# EAGLE design bird_beaks 3.0 (EAGLE 9.6.2)

## Sheet 1 of 2
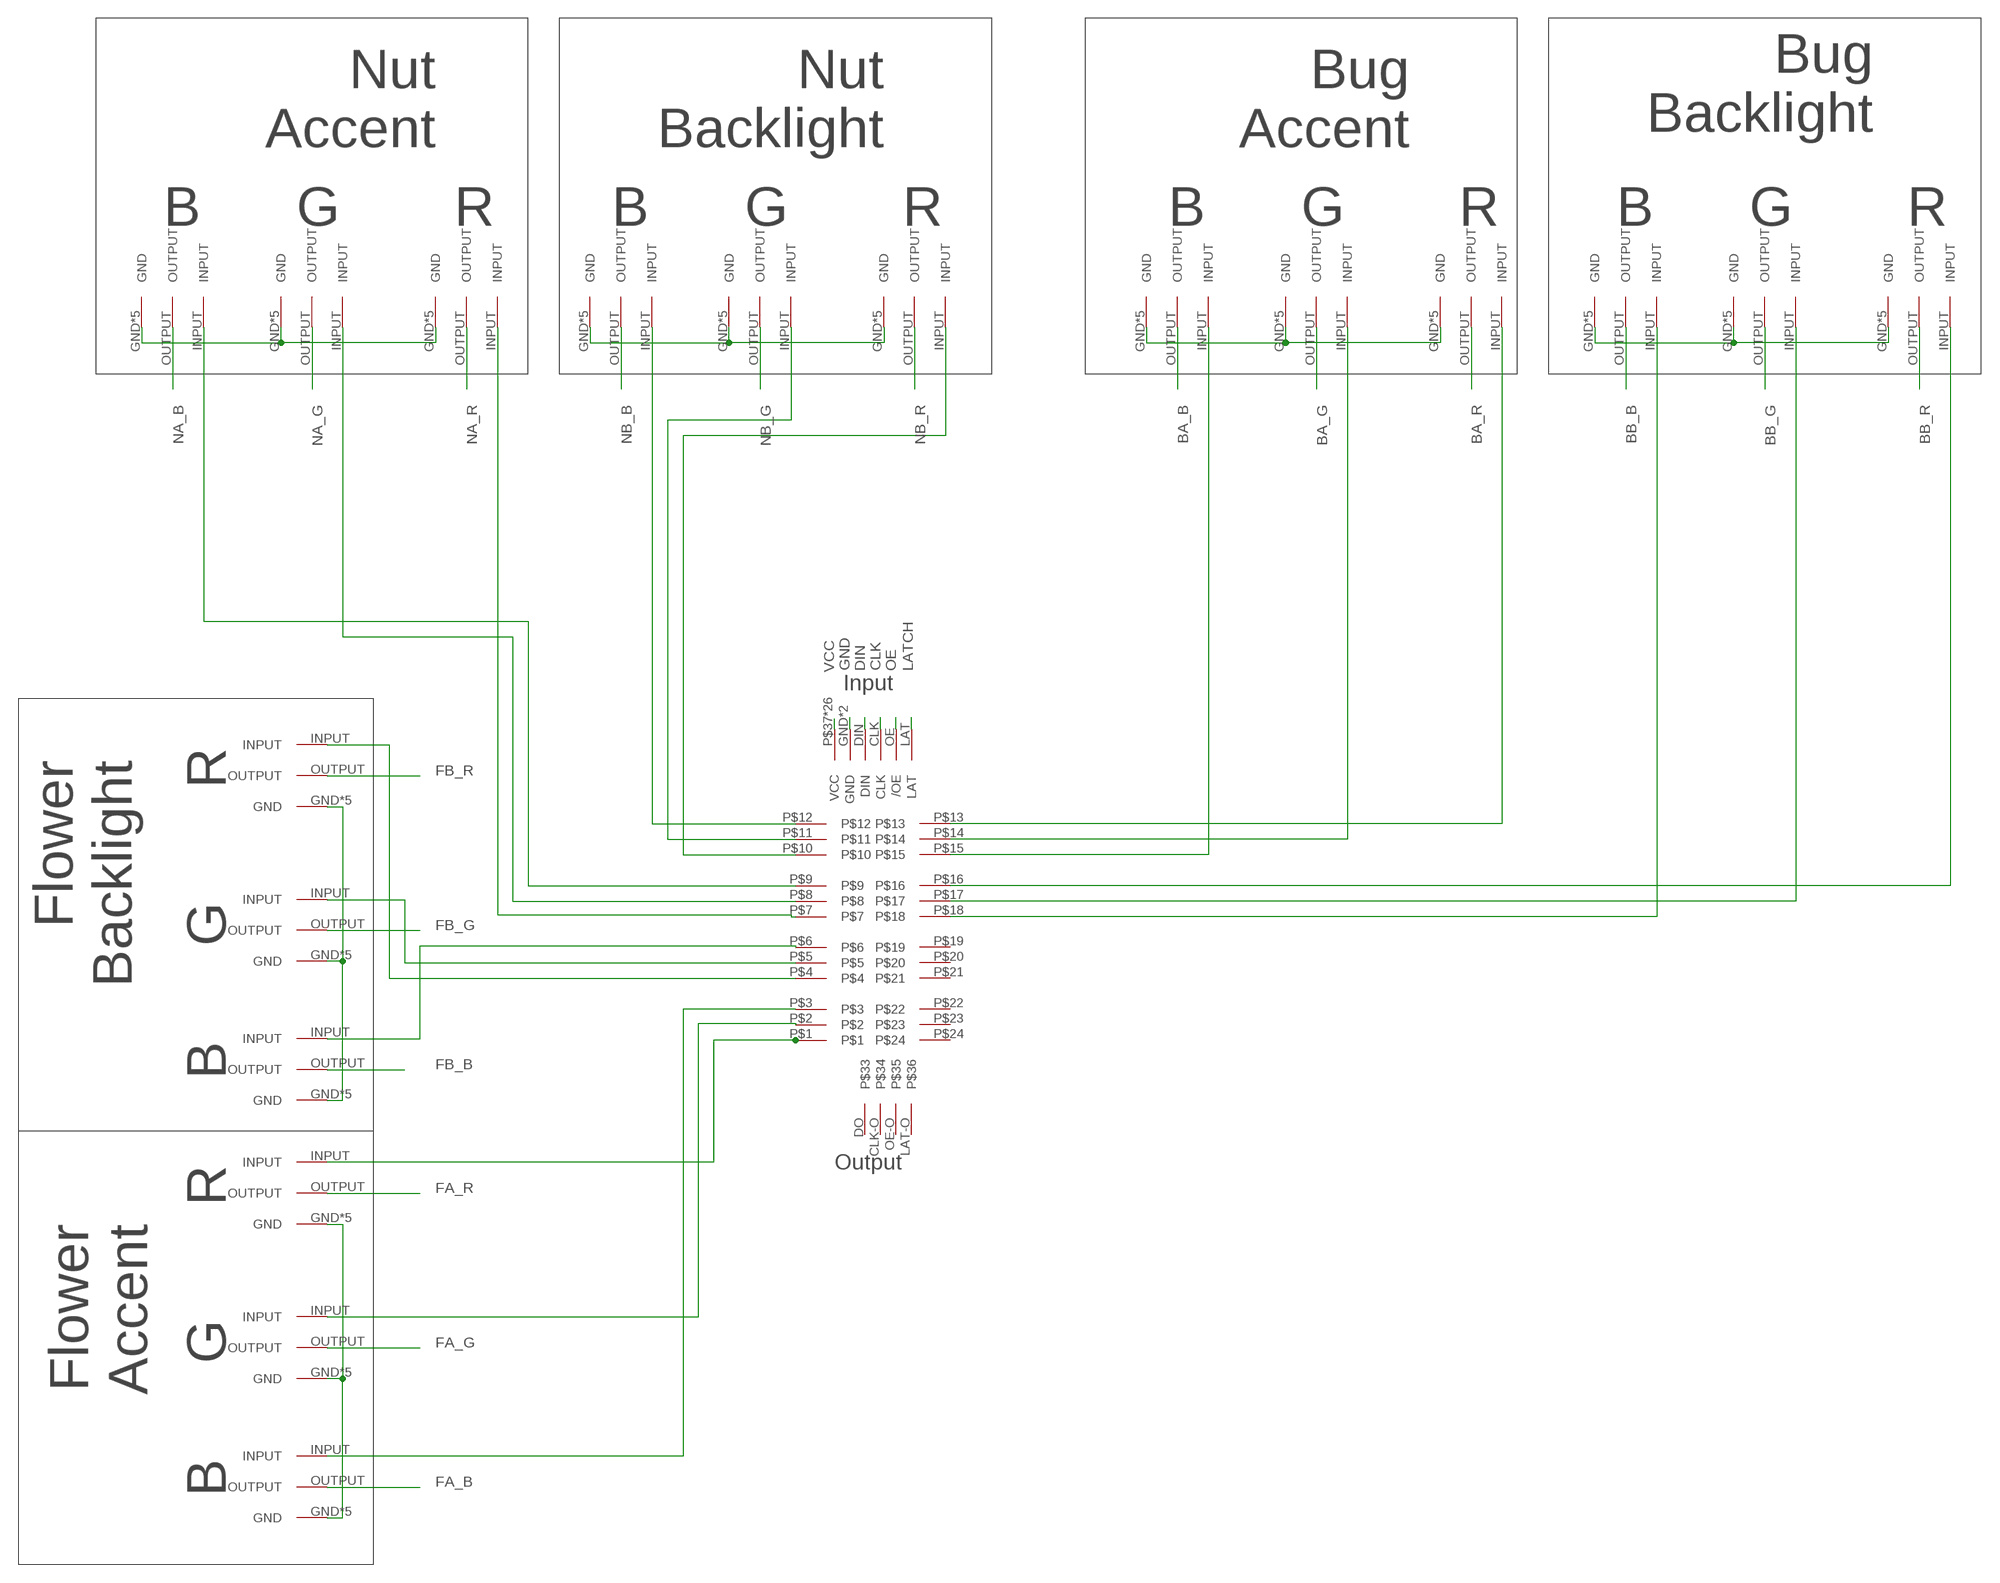
[diagram p0: schematic, sheet 1]

### Parts
U$1  TLC5847  [TLC5947]
U$2  MODULE_MOSFET  [MODULE_MOSFET]
U$3  MODULE_MOSFET  [MODULE_MOSFET]
U$4  MODULE_MOSFET  [MODULE_MOSFET]
U$5  MODULE_MOSFET  [MODULE_MOSFET]
U$6  MODULE_MOSFET  [MODULE_MOSFET]
U$7  MODULE_MOSFET  [MODULE_MOSFET]
U$8  MODULE_MOSFET  [MODULE_MOSFET]
U$9  MODULE_MOSFET  [MODULE_MOSFET]
U$10  MODULE_MOSFET  [MODULE_MOSFET]
U$11  MODULE_MOSFET  [MODULE_MOSFET]
U$12  MODULE_MOSFET  [MODULE_MOSFET]
U$13  MODULE_MOSFET  [MODULE_MOSFET]
U$14  MODULE_MOSFET  [MODULE_MOSFET]
U$15  MODULE_MOSFET  [MODULE_MOSFET]
U$16  MODULE_MOSFET  [MODULE_MOSFET]
U$17  MODULE_MOSFET  [MODULE_MOSFET]
U$18  MODULE_MOSFET  [MODULE_MOSFET]
U$19  MODULE_MOSFET  [MODULE_MOSFET]

### Nets
BA_B [High Power]: U$14.OUTPUT ; also sheet 2
BA_G [High Power]: U$16.OUTPUT ; also sheet 2
BA_R [High Power]: U$15.OUTPUT ; also sheet 2
BB_B [High Power]: U$17.OUTPUT ; also sheet 2
BB_G [High Power]: U$19.OUTPUT ; also sheet 2
BB_R [High Power]: U$18.OUTPUT ; also sheet 2
CLK: U$1.CLK ; also sheet 2
DIN: U$1.DIN ; also sheet 2
FA_B [High Power]: U$5.OUTPUT ; also sheet 2
FA_G [High Power]: U$7.OUTPUT ; also sheet 2
FA_R [High Power]: U$6.OUTPUT ; also sheet 2
FB_B [High Power]: U$2.OUTPUT ; also sheet 2
FB_G [High Power]: U$4.OUTPUT ; also sheet 2
FB_R [High Power]: U$3.OUTPUT ; also sheet 2
GND [High Power]: U$1.GND U$1.GND-O(GND) ; also sheet 2
LATCH: U$1.LAT ; also sheet 2
N$4: U$1.P$1 U$6.INPUT
N$5: U$5.GND U$5.GND1(GND) U$5.GND2(GND) U$5.GND3(GND) U$5.GND4(GND) U$6.GND U$6.GND1(GND) U$6.GND2(GND) U$6.GND3(GND) U$6.GND4(GND) U$7.GND U$7.GND1(GND) U$7.GND2(GND) U$7.GND3(GND) U$7.GND4(GND)
N$6: U$8.GND U$8.GND1(GND) U$8.GND2(GND) U$8.GND3(GND) U$8.GND4(GND) U$9.GND U$9.GND1(GND) U$9.GND2(GND) U$9.GND3(GND) U$9.GND4(GND) U$10.GND U$10.GND1(GND) U$10.GND2(GND) U$10.GND3(GND) U$10.GND4(GND)
N$9: U$2.GND U$2.GND1(GND) U$2.GND2(GND) U$2.GND3(GND) U$2.GND4(GND) U$3.GND U$3.GND1(GND) U$3.GND2(GND) U$3.GND3(GND) U$3.GND4(GND) U$4.GND U$4.GND1(GND) U$4.GND2(GND) U$4.GND3(GND) U$4.GND4(GND)
N$14: U$11.GND U$11.GND1(GND) U$11.GND2(GND) U$11.GND3(GND) U$11.GND4(GND) U$12.GND U$12.GND1(GND) U$12.GND2(GND) U$12.GND3(GND) U$12.GND4(GND) U$13.GND U$13.GND1(GND) U$13.GND2(GND) U$13.GND3(GND) U$13.GND4(GND)
N$15: U$1.P$6 U$2.INPUT
N$16: U$14.GND U$14.GND1(GND) U$14.GND2(GND) U$14.GND3(GND) U$14.GND4(GND) U$15.GND U$15.GND1(GND) U$15.GND2(GND) U$15.GND3(GND) U$15.GND4(GND) U$16.GND U$16.GND1(GND) U$16.GND2(GND) U$16.GND3(GND) U$16.GND4(GND)
N$17: U$17.GND U$17.GND1(GND) U$17.GND2(GND) U$17.GND3(GND) U$17.GND4(GND) U$18.GND U$18.GND1(GND) U$18.GND2(GND) U$18.GND3(GND) U$18.GND4(GND) U$19.GND U$19.GND1(GND) U$19.GND2(GND) U$19.GND3(GND) U$19.GND4(GND)
N$18: U$1.P$2 U$7.INPUT
N$19: U$1.P$12 U$11.INPUT
N$20: U$1.P$3 U$5.INPUT
N$21: U$1.P$10 U$12.INPUT
N$22: U$1.P$4 U$3.INPUT
N$23: U$1.P$5 U$4.INPUT
N$24: U$1.P$11 U$13.INPUT
N$25: U$1.P$7 U$9.INPUT
N$26: U$1.P$8 U$10.INPUT
N$27: U$1.P$9 U$8.INPUT
N$28: U$1.P$13 U$15.INPUT
N$29: U$1.P$14 U$16.INPUT
N$30: U$1.P$15 U$14.INPUT
N$31: U$1.P$16 U$18.INPUT
N$32: U$1.P$17 U$19.INPUT
N$33: U$1.P$18 U$17.INPUT
NA_B [High Power]: U$8.OUTPUT ; also sheet 2
NA_G [High Power]: U$10.OUTPUT ; also sheet 2
NA_R [High Power]: U$9.OUTPUT ; also sheet 2
NB_B [High Power]: U$11.OUTPUT ; also sheet 2
NB_G [High Power]: U$13.OUTPUT ; also sheet 2
NB_R [High Power]: U$12.OUTPUT ; also sheet 2
OE: U$1.OE(/OE) ; also sheet 2
VCC [High Power]: U$1.P$37(VCC) U$1.P$38(VCC) U$1.P$39(VCC) U$1.P$40(VCC) U$1.P$41(VCC) U$1.P$42(VCC) U$1.P$43(VCC) U$1.P$44(VCC) U$1.P$45(VCC) U$1.P$46(VCC) U$1.P$47(VCC) U$1.P$48(VCC) U$1.P$49(VCC) U$1.P$50(VCC) U$1.P$51(VCC) U$1.P$52(VCC) U$1.P$53(VCC) U$1.P$54(VCC) U$1.P$55(VCC) U$1.P$56(VCC) U$1.P$57(VCC) U$1.P$58(VCC) U$1.P$59(VCC) U$1.P$60(VCC) U$1.VCC U$1.VCC-O(VCC) ; also sheet 2
Unconnected: U$1.CLK-O U$1.DO U$1.LAT-O U$1.OE-O U$1.P$19 U$1.P$20 U$1.P$21 U$1.P$22 U$1.P$23 U$1.P$24

### Notes on the sheet
- Bug
  Backlight
- Nut
  Accent
- Nut
  Backlight
- Bug
  Accent
- B | G | R | B | G | R | B | G | R | B | G | R
- R
- Flower
  Backlight
- G
- B
- R
- Flower
  Accent
- G
- B

## Sheet 2 of 2
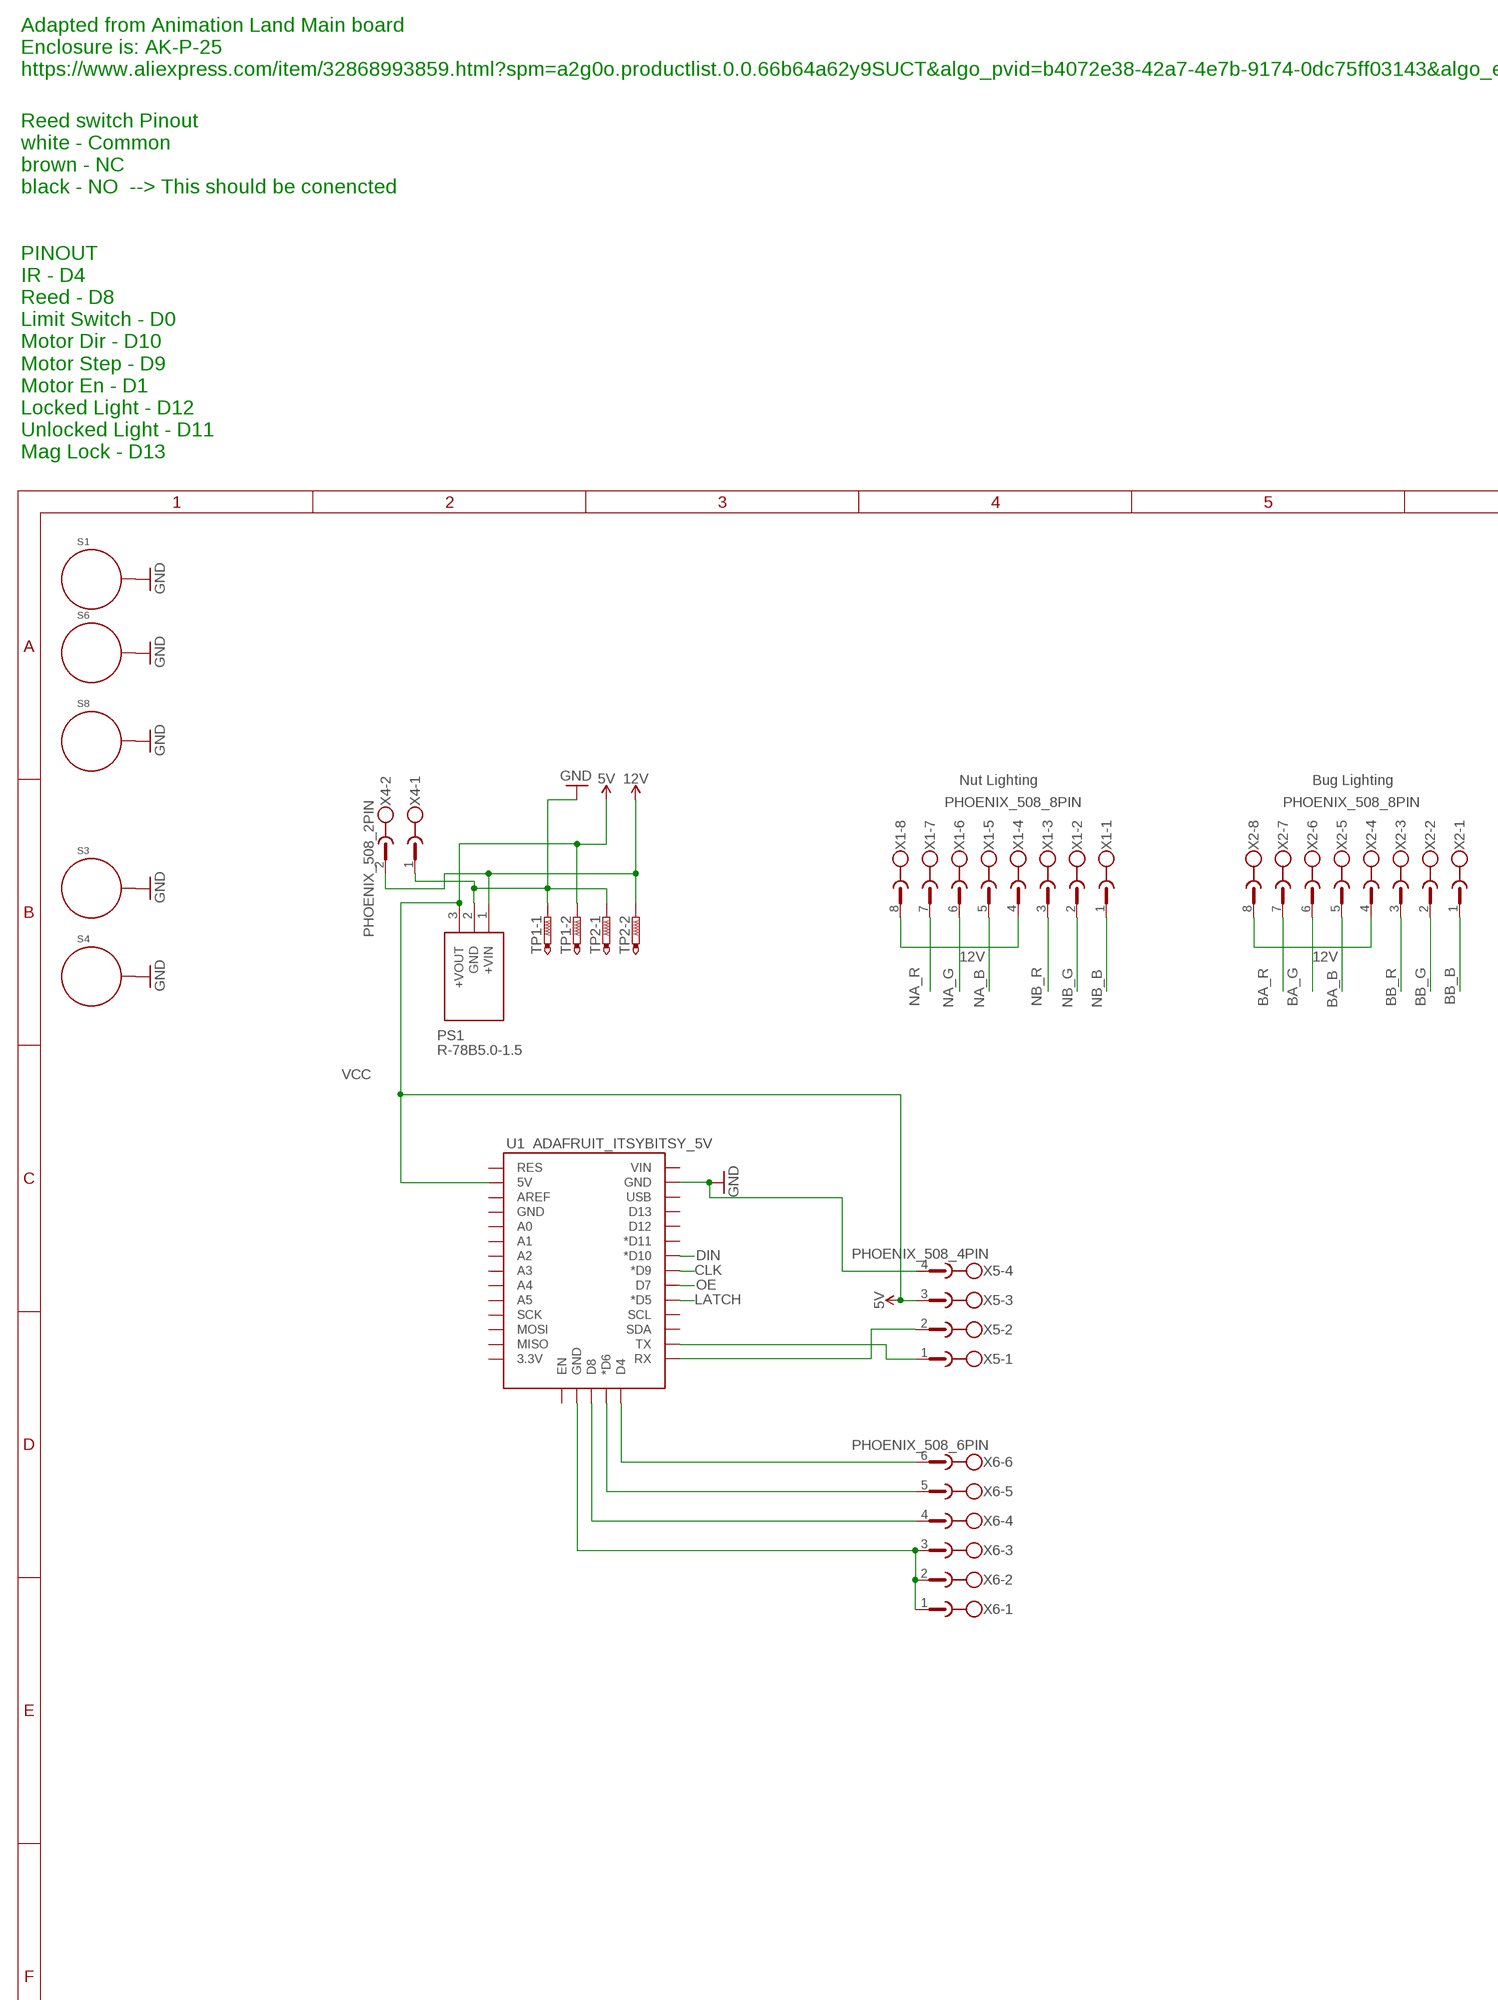
[diagram p1: schematic, sheet 2, part 1 of 2]
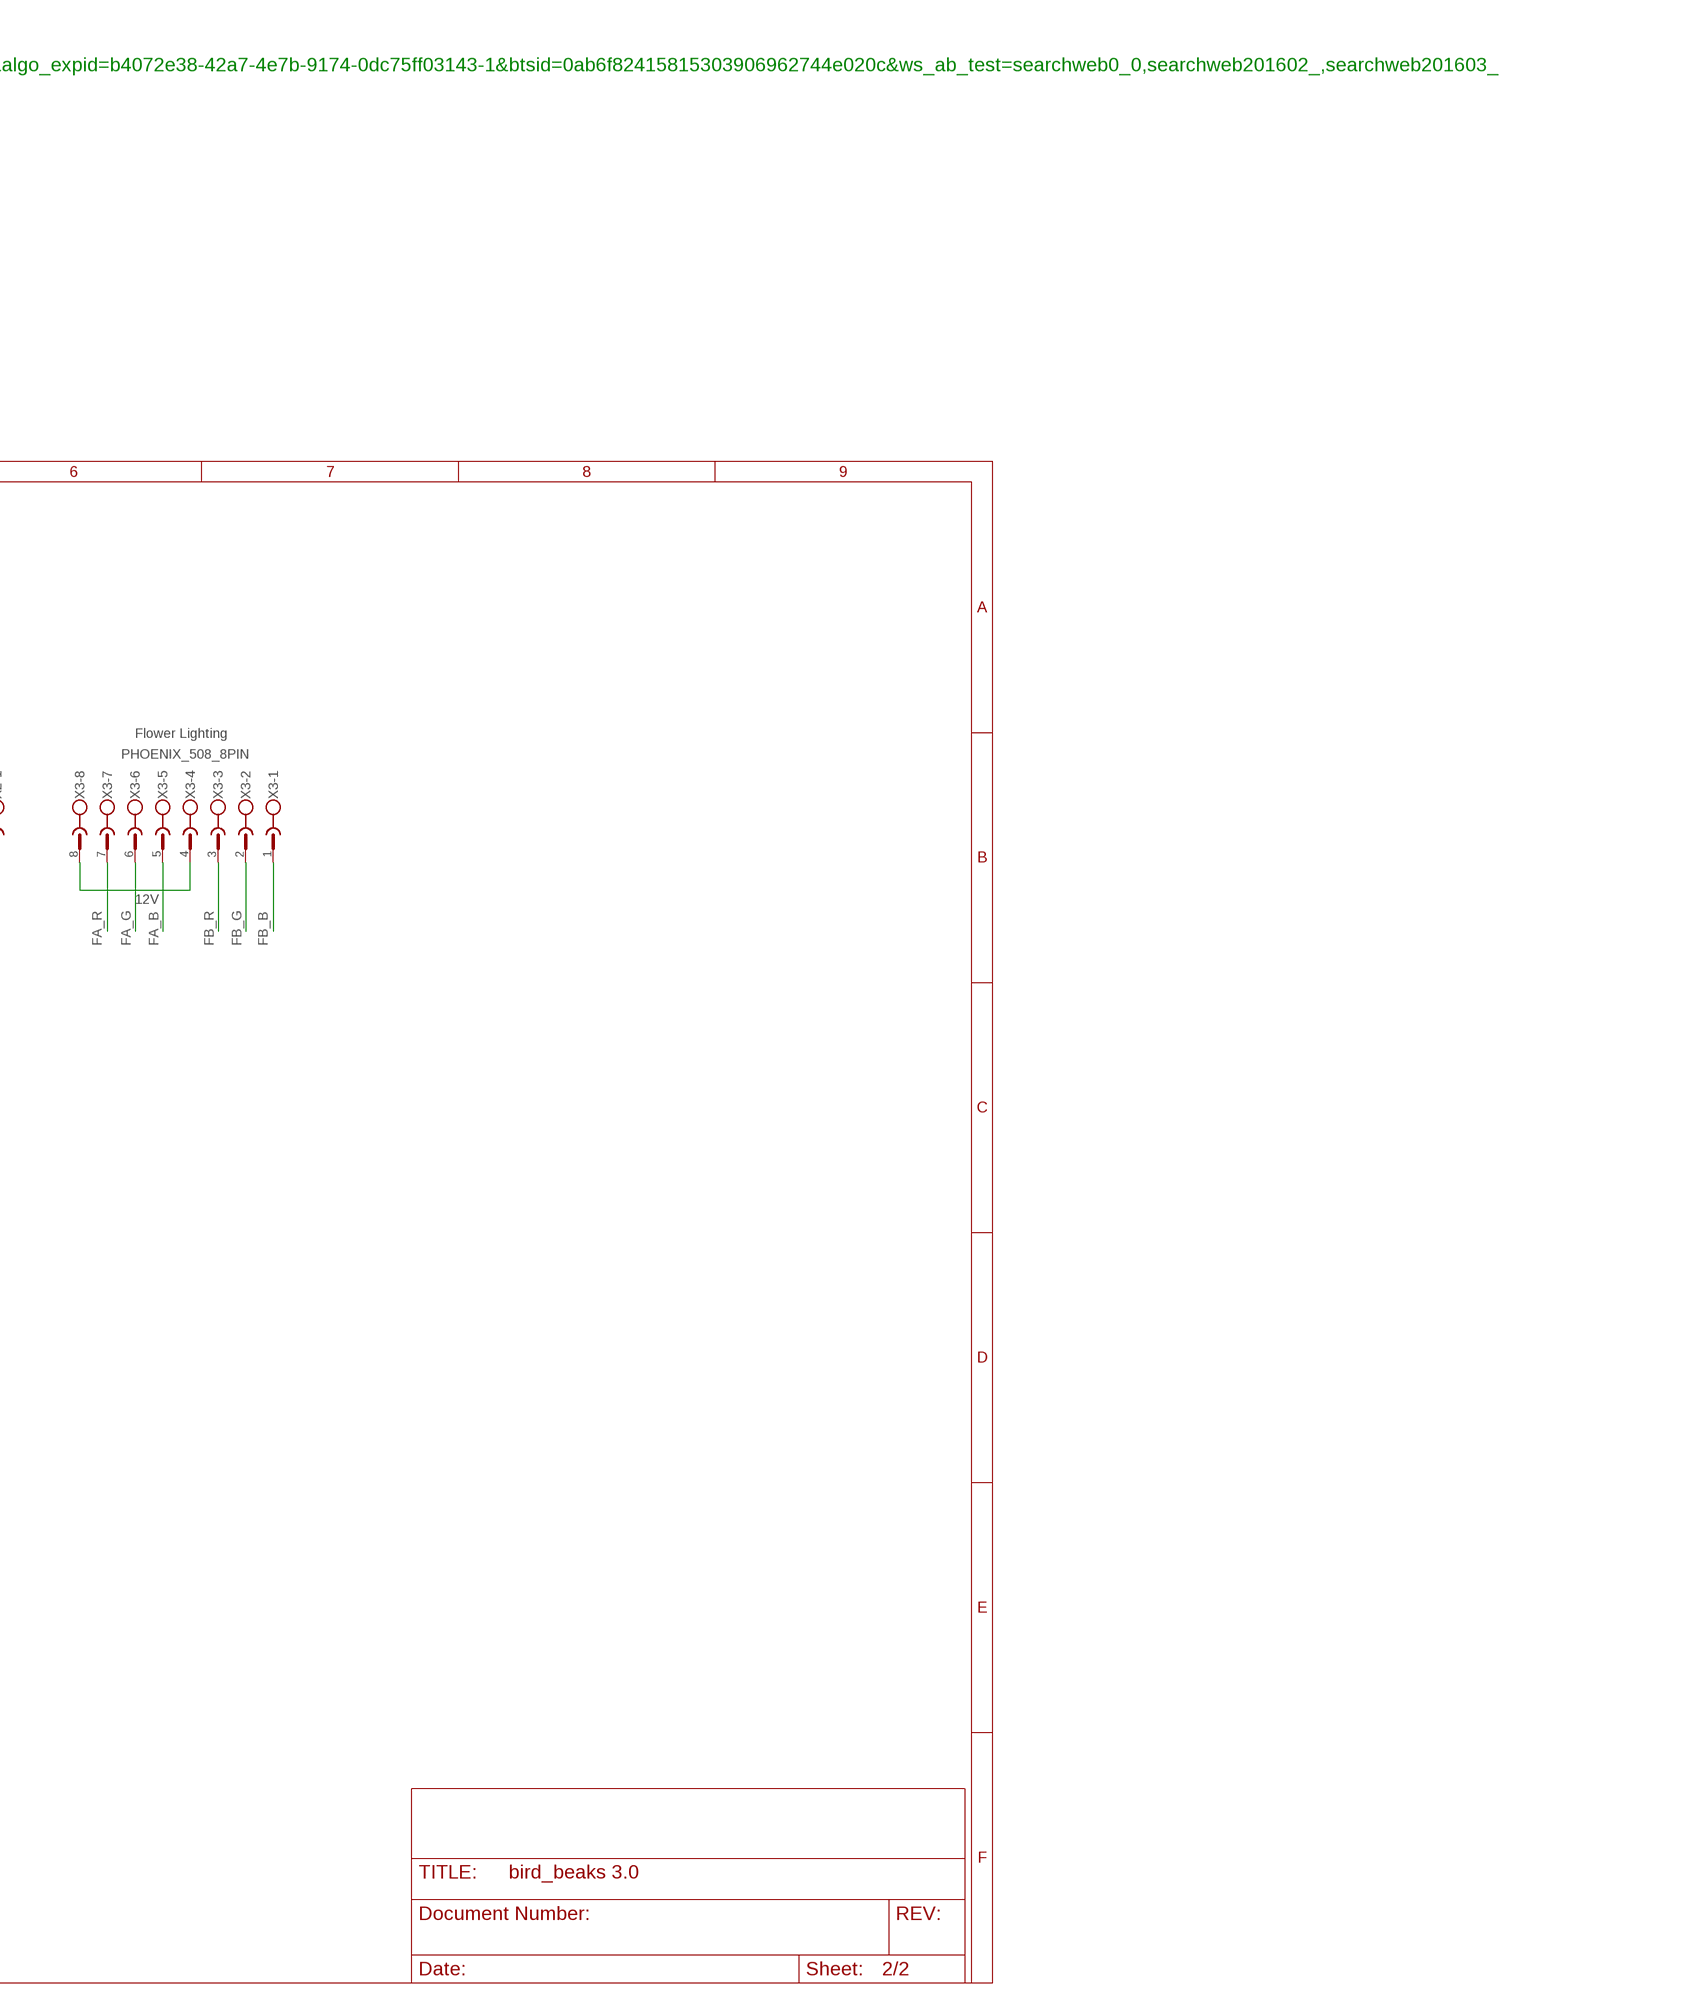
[diagram p2: schematic, sheet 2, part 2 of 2]

### Parts
PS1  R-78B5.0-1.5  [R78B5015]
S1  STANDOFF_ELECTRICAL5-32  [STANDOFF_ELECTRICAL_5_32]
S3  STANDOFF_ELECTRICAL5-32  [STANDOFF_ELECTRICAL_5_32]
S4  STANDOFF_ELECTRICAL5-32  [STANDOFF_ELECTRICAL_5_32]
S6  STANDOFF_ELECTRICAL5-32  [STANDOFF_ELECTRICAL_5_32]
S8  STANDOFF_ELECTRICAL5-32  [STANDOFF_ELECTRICAL_5_32]
TP1  PTR2  [P2-38-17]
TP2  PTR2  [P2-38-17]
U1  ADAFRUIT_ITSYBITSY_5V  [ADAFRUIT_ITSYBITSY]
X1  PHOENIX_508_8PIN  [PHOENIX_508_8PIN]
X2  PHOENIX_508_8PIN  [PHOENIX_508_8PIN]
X3  PHOENIX_508_8PIN  [PHOENIX_508_8PIN]
X4  PHOENIX_508_2PIN  [PHOENIX_508_2PIN]
X5  PHOENIX_508_4PIN  [PHOENIX_508_4PIN]
X6  PHOENIX_508_6PIN  [PHOENIX_508_6PIN]

### Nets
12V [High Power]: PS1.1(+VIN) TP2.TP-2 X1.4 X1.8 X2.4 X2.8 X3.4 X3.8 X4.2
BA_B [High Power]: X2.5 ; also sheet 1
BA_G [High Power]: X2.6 ; also sheet 1
BA_R [High Power]: X2.7 ; also sheet 1
BB_B [High Power]: X2.1 ; also sheet 1
BB_G [High Power]: X2.2 ; also sheet 1
BB_R [High Power]: X2.3 ; also sheet 1
CLK: U1.D9(*D9) ; also sheet 1
DIN: U1.D10(*D10) ; also sheet 1
FA_B [High Power]: X3.5 ; also sheet 1
FA_G [High Power]: X3.6 ; also sheet 1
FA_R [High Power]: X3.7 ; also sheet 1
FB_B [High Power]: X3.1 ; also sheet 1
FB_G [High Power]: X3.2 ; also sheet 1
FB_R [High Power]: X3.3 ; also sheet 1
GND [High Power]: PS1.2(GND) S1.P1 S3.P1 S4.P1 S6.P1 S8.P1 TP1.TP-1 TP2.TP-1 U1.GND@2(GND) X4.1 X5.4 ; also sheet 1
LATCH: U1.D5(*D5) ; also sheet 1
N$1: U1.D4 X6.6
N$2: U1.D6(*D6) X6.5
N$3: U1.D8 X6.4
N$7: U1.GND@1(GND) X6.1 X6.2 X6.3
N$8: U1.TX X5.1
N$10: U1.RX X5.2
NA_B [High Power]: X1.5 ; also sheet 1
NA_G [High Power]: X1.6 ; also sheet 1
NA_R [High Power]: X1.7 ; also sheet 1
NB_B [High Power]: X1.1 ; also sheet 1
NB_G [High Power]: X1.2 ; also sheet 1
NB_R [High Power]: X1.3 ; also sheet 1
OE: U1.D7 ; also sheet 1
VCC [High Power]: PS1.3(+VOUT) TP1.TP-2 U1.5V X5.3 ; supply symbol labelled 5V ; also sheet 1
Unconnected: U1.3V(3.3V) U1.A0 U1.A1 U1.A2 U1.A3 U1.A4 U1.A5 U1.AREF U1.D11(*D11) U1.D12 U1.D13 U1.EN U1.GND@0(GND) U1.MISO U1.MOSI U1.RES U1.SCK U1.SCL U1.SDA U1.USB U1.VIN

### Notes on the sheet
- Adapted from Animation Land Main board
  Enclosure is: AK-P-25
  https://www.aliexpress.com/item/32868993859.html?spm=a2g0o.productlist.0.0.66b64a62y9SUCT&algo_pvid=b4072e38-42a7-4e7b-9174-0dc75ff03143&algo_expid=b4072e38-42a7-4e7b-9174-0dc75ff03143-1&btsid=0ab6f82415815303906962744e020c&ws_ab_test=searchweb0_0,searchweb201602_,searchweb201603_
- Reed switch Pinout
  white - Common
  brown - NC
  black - NO  --> This should be conencted
  
  
  PINOUT
  IR - D4
  Reed - D8
  Limit Switch - D0
  Motor Dir - D10
  Motor Step - D9
  Motor En - D1
  Locked Light - D12
  Unlocked Light - D11
  Mag Lock - D13
- Nut Lighting | Bug Lighting | Flower Lighting

## Library data of the parts
PS1 = OMSI_Default_V1:R-78B5.0-1.5: Recom Switching Regulator, 6.5 18 V, 8 18 V Input, 5V Output, 1.5A Source: Datasheet <https://www.recom-power.com/pdf/Innoline/R-78Bxx-1.5_L.pdf>; DESCRIPTION: Recom Switching Regulator, 6.5 18 V, 8 18 V Input, 5V Output, 1.5A; HEIGHT: 18mm; MANUFACTURER_NAME: RECOM Power; MANUFACTURER_PART_NUMBER: R-78B5.0-1.5; MOUSER_PART_NUMBER: 919-R-78B5.0-1.5; MOUSER_PRICE-STOCK: https://www.mouser.co.uk/ProductDetail/RECOM-Power/R-78B5.0-1.5?qs=YWgezujkI1JgY7IeN1uB3w%3D%3D
S1 S3 S4 S6 S8 = th_libraries:STANDOFF_ELECTRICAL: A standoff intended to be an electrically connected point. Pad size and stop size allow for a #8 Phillips pan screw head to make a solid connection to the board. Added 144mill drill hole that fits my normal wood screw
TP1 TP2 = testpad:PTR2: TEST PIN
U1 = OMSI_Default_V1:ADAFRUIT_ITSYBITSY_5V: Adafruit ItsyBitsy 32u4 - 5V 16MHz https://www.adafruit.com/product/3677
U$1 = OMSI_Default_V1:TLC5847
U$2-U$19 = OMSI_Default_V1:MODULE_MOSFET
X1-X3 = OMSI_Default_V1:PHOENIX_508_8PIN: PHOENIX; MF: FARNELL; MPN: 1757307; OC_FARNELL: 3705225; OC_NEWARK: 71C4166
X4 = OMSI_Default_V1:PHOENIX_508_2PIN: PHOENIX; MF: FARNELL; MPN: 1757242; OC_FARNELL: 3705171; OC_NEWARK: 71C4161
X5 = OMSI_Default_V1:PHOENIX_508_4PIN: PHOENIX; MF: FARNELL; MPN: 1757268; OC_FARNELL: 3705195; OC_NEWARK: 71C4163
X6 = OMSI_Default_V1:PHOENIX_508_6PIN: PHOENIX; MF: FARNELL; MPN: 1757284; OC_FARNELL: 3705213; OC_NEWARK: 71C4165

## Net classes
0 Low Power: width 0.152 mm, drill 0.254 mm
1 High Power: width 0.762 mm, drill 0.483 mm

## Board
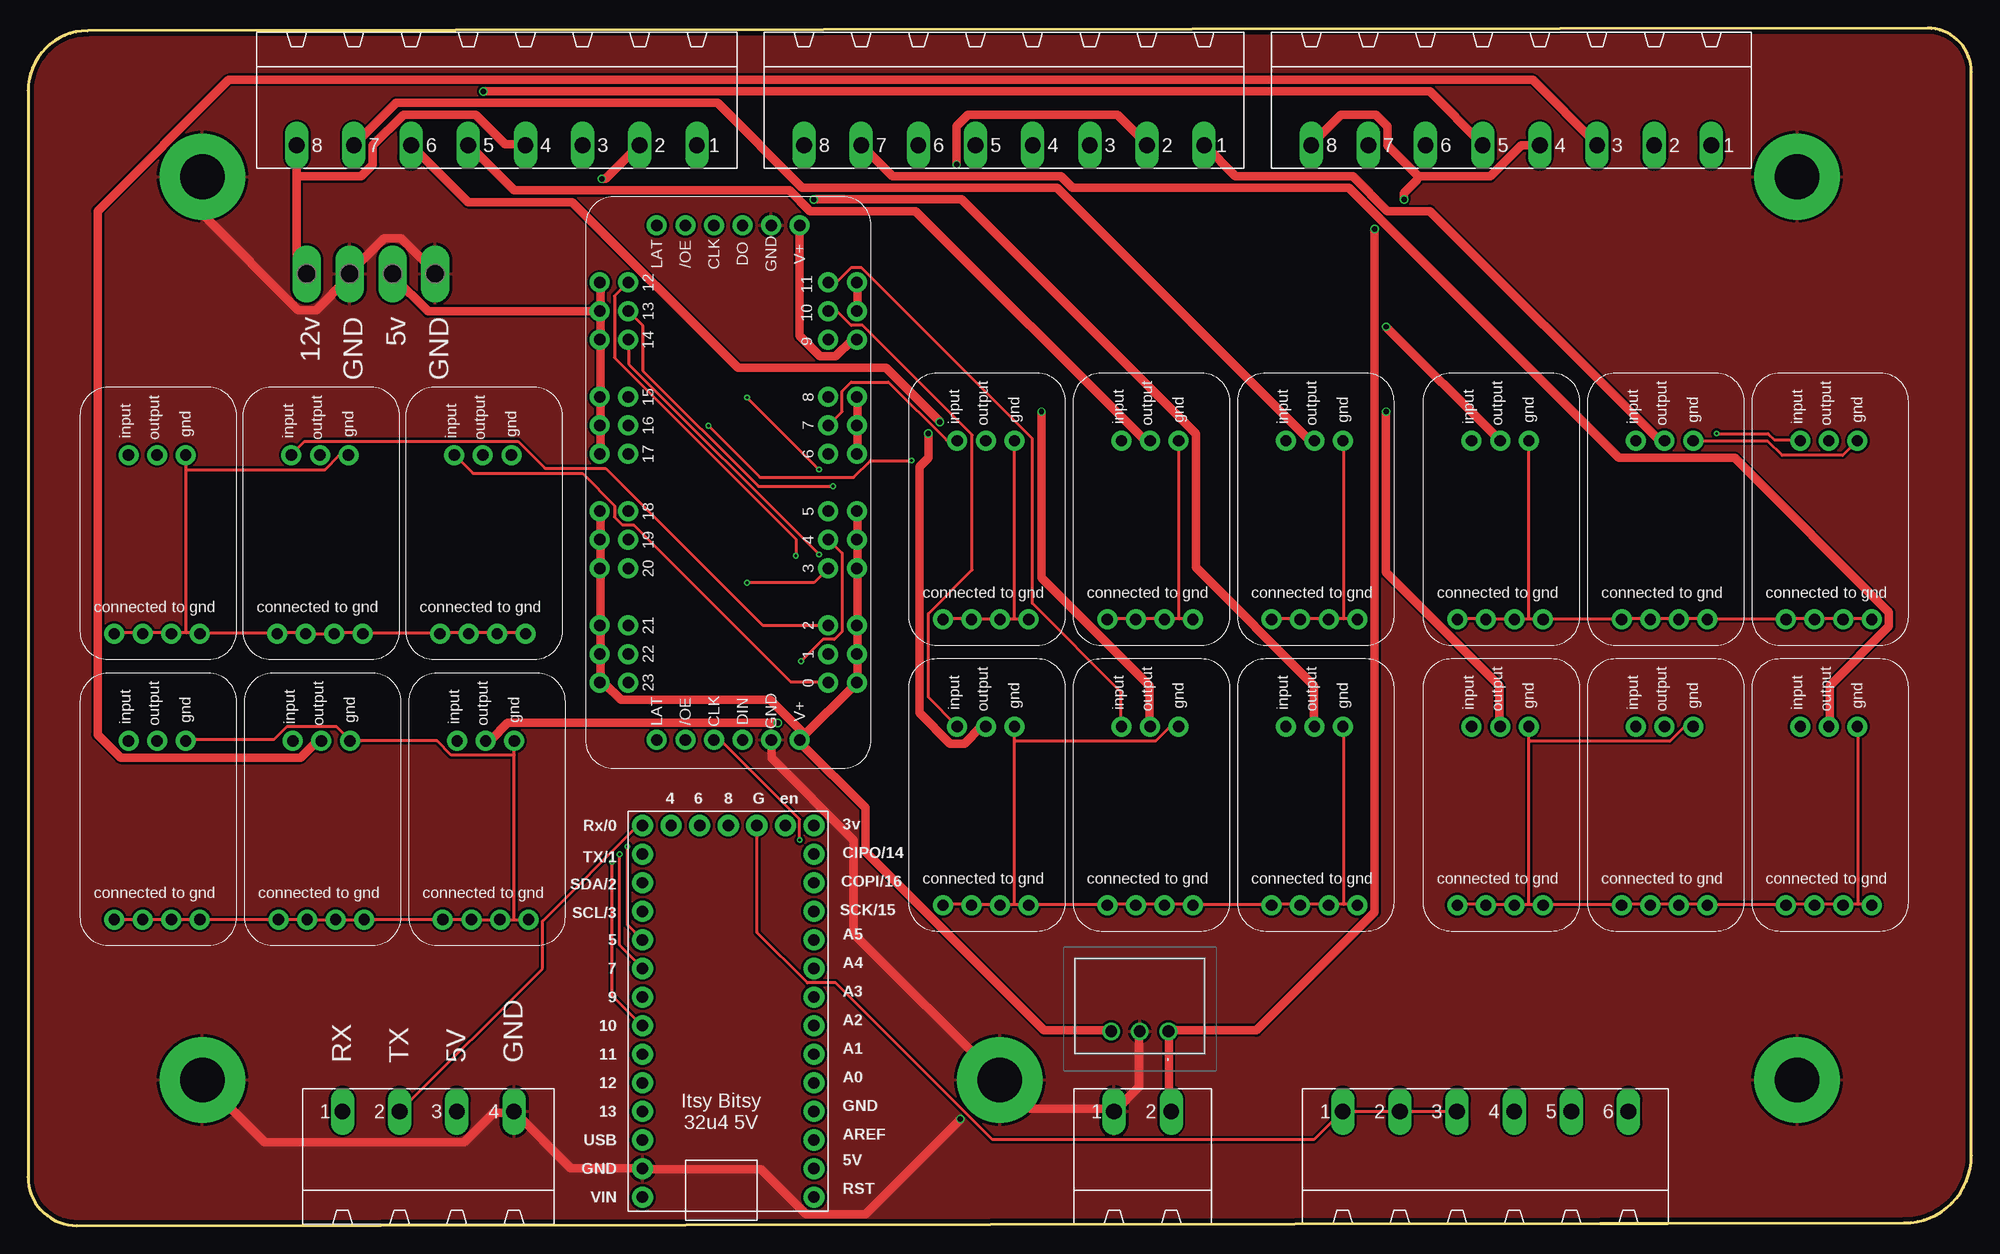
[diagram p3: board, top side]
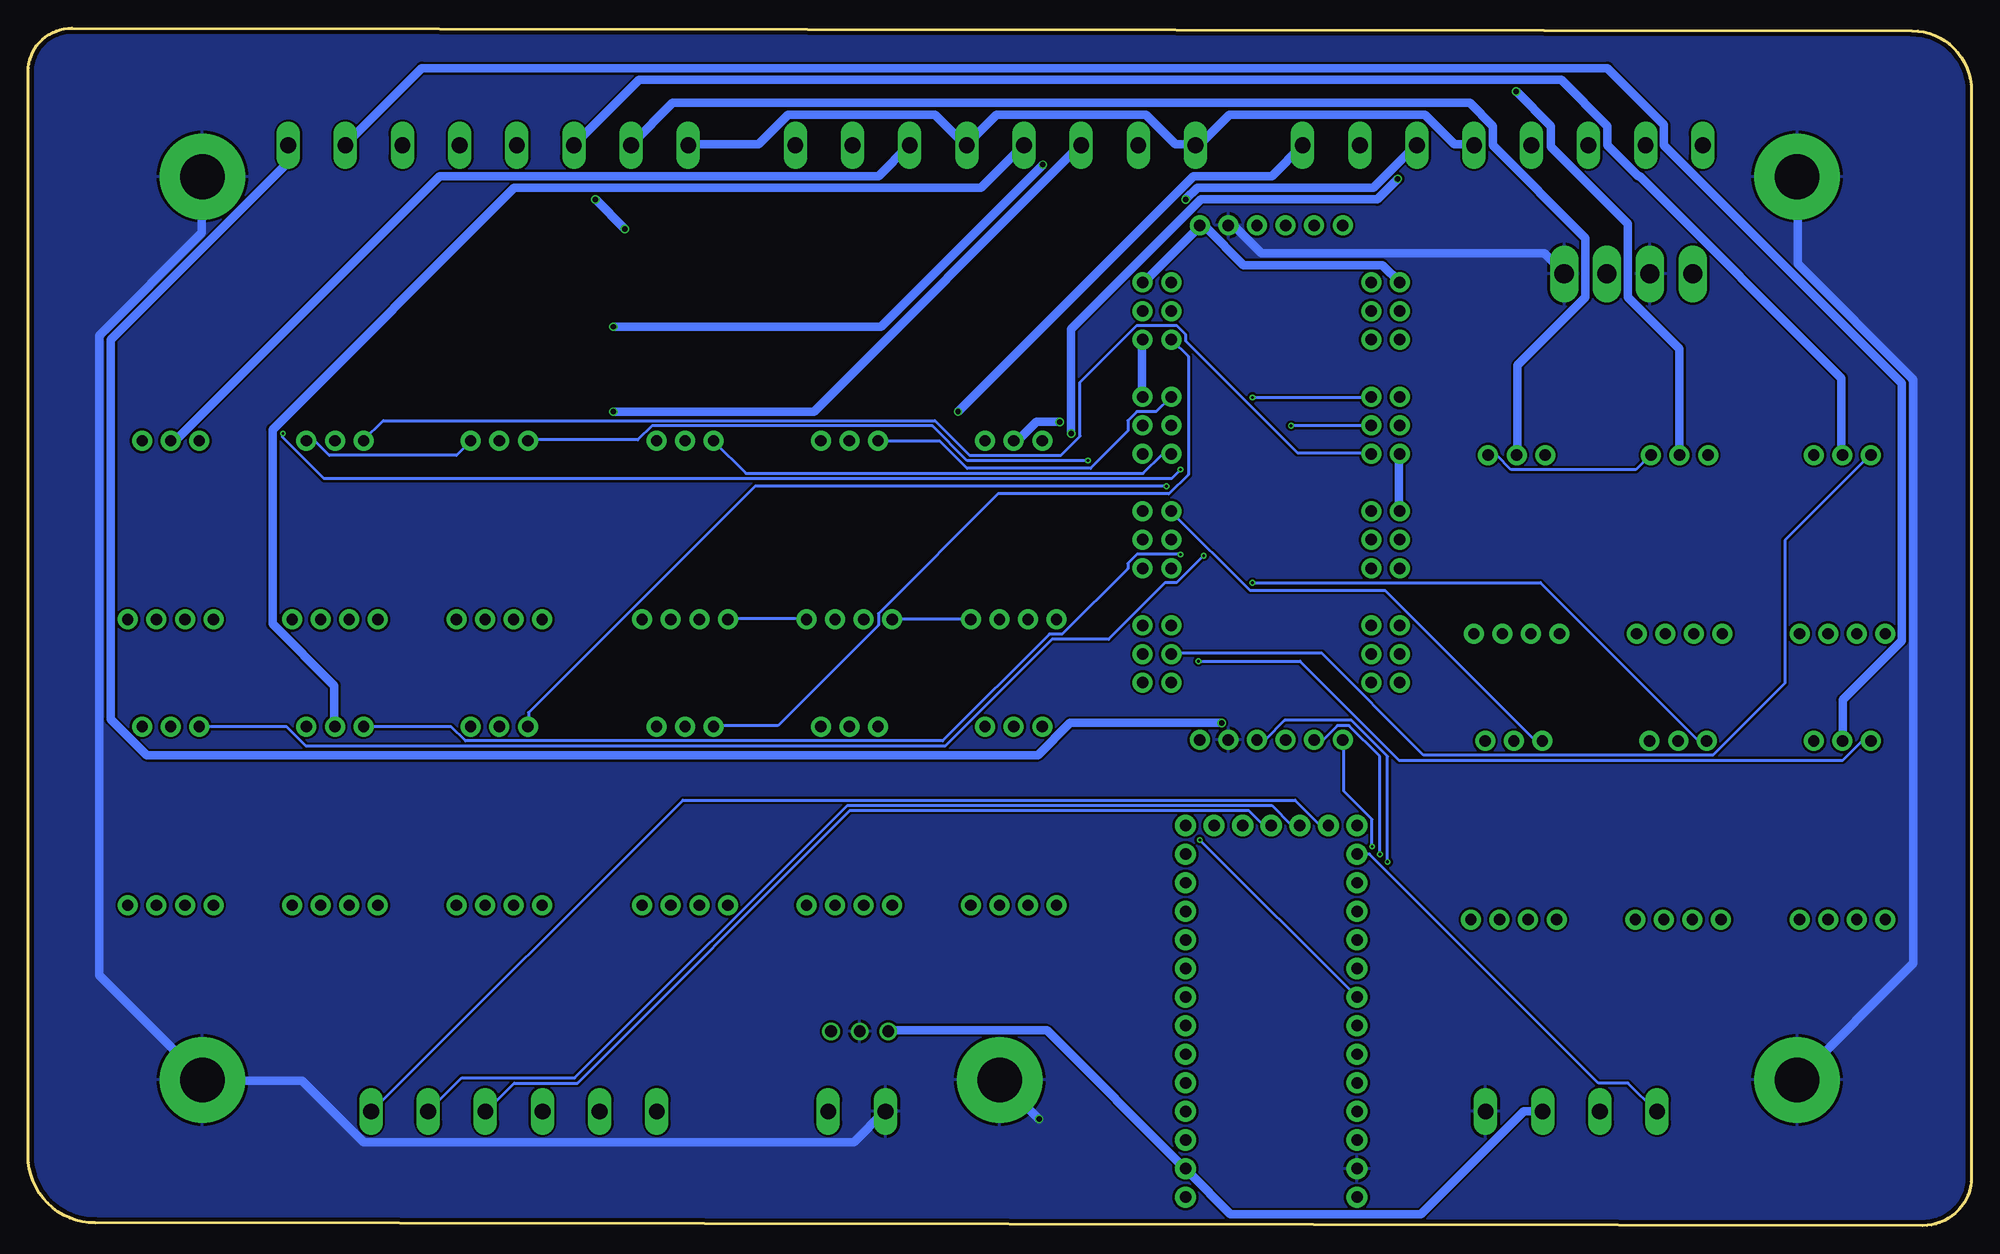
[diagram p4: board, bottom side, seen from below]

Size 172.72 x 106.41 mm. Coordinates in mm from the lower left corner, seen from the top.
Outline: 168.83,106.41 5.28,106.17 arc90 0,100.89 0,4.33 arc90 4.33,0 166.75,0.24 arc90 172.72,6.22 172.72,102.53 arc90 168.83,106.41
Copper layers (1*16): Top 0.035559375mm / dielectric 1.6mm / Bottom 0.035559375mm
Design rules "oshpark-2layer (1) *": minimum track width 10mil, minimum drill 10mil, track to track 8mil, track to pad 8mil, pad to pad 8mil, via to via 8mil, smd to smd 8mil, copper to edge 15mil, drill to drill 6mil, minimum pad ring 5mil, minimum via ring 5mil, stop-mask expansion 2.5mil, vias tented up to drill 25mil, thermal gap 10mil

### Footprints (pad centres in the part's own frame; a part is rotated, then mirrored left to right if it is on the bottom)
R78B5015 = drill 1.05 pad 1.575: 1 0,0; 2 2.54,0; 3 5.08,0
STANDOFF_ELECTRICAL_5_32 = drill 3.969 pad 7.62: P1 0,0
P2-38-17 = drill 1.702 pad 2.121 long: TP-1 -1.905,0; TP-2 1.905,0
ADAFRUIT_ITSYBITSY = drill 1.016 pad 1.88: 3V -7.62,-16.51; 5V -7.62,13.97; A0 -7.62,6.35; A1 -7.62,3.81; A2 -7.62,1.27; A3 -7.62,-1.27; A4 -7.62,-3.81; A5 -7.62,-6.35; AREF -7.62,11.43; D4 5.08,-16.51; D5 7.62,-6.35; D6 2.54,-16.51; D7 7.62,-3.81; D8 0,-16.51; D9 7.62,-1.27; D10 7.62,1.27; D11 7.62,3.81; D12 7.62,6.35; D13 7.62,8.89; EN -5.08,-16.51; GND@0 -7.62,8.89; GND@1 -2.54,-16.51; GND@2 7.62,13.97; MISO -7.62,-13.97; MOSI -7.62,-11.43; RES -7.62,16.51; RX 7.62,-16.51; SCK -7.62,-8.89; SCL 7.62,-8.89; SDA 7.62,-11.43; TX 7.62,-13.97; USB 7.62,11.43; VIN 7.62,16.51
TLC5947 = drill 1.02 pad 1.778: CLK -22.86,1.27; CLK-O 22.86,1.27; DIN -22.86,-1.27; DO 22.86,-1.27; GND -22.86,-3.81; GND-O 22.86,-3.81; LAT -22.86,6.35; LAT-O 22.86,6.35; OE -22.86,3.81; OE-O 22.86,3.81; P$1 -17.78,-8.89; P$2 -15.24,-8.89; P$3 -12.7,-8.89; P$4 -7.62,-8.89; P$5 -5.08,-8.89; P$6 -2.54,-8.89; P$7 2.54,-8.89; P$8 5.08,-8.89; P$9 7.62,-8.89; P$10 12.7,-8.89; P$11 15.24,-8.89; P$12 17.78,-8.89; P$13 17.78,8.89; P$14 15.24,8.89; P$15 12.7,8.89; P$16 7.62,8.89; P$17 5.08,8.89; P$18 2.54,8.89; P$19 -2.54,8.89; P$20 -5.08,8.89; P$21 -7.62,8.89; P$22 -12.7,8.89; P$23 -15.24,8.89; P$24 -17.78,8.89; P$37 -17.78,-11.43; P$38 -15.24,-11.43; P$39 -12.7,-11.43; P$40 -7.62,-11.43; P$41 -5.08,-11.43; P$42 -2.54,-11.43; P$43 2.54,-11.43; P$44 5.08,-11.43; P$45 7.62,-11.43; P$46 12.7,-11.43; P$47 15.24,-11.43; P$48 17.78,-11.43; P$49 -17.78,11.43; P$50 -15.24,11.43; P$51 -12.7,11.43; P$52 -7.62,11.43; P$53 -5.08,11.43; P$54 -2.54,11.43; P$55 2.54,11.43; P$56 5.08,11.43; P$57 7.62,11.43; P$58 12.7,11.43; P$59 15.24,11.43; P$60 17.78,11.43; VCC -22.86,-6.35; VCC-O 22.86,-6.35
MODULE_MOSFET = drill 1 pad 1.778: GND 2.57,7.523; GND1 -3.78,-8.35; GND2 -1.24,-8.35; GND3 1.3,-8.35; GND4 3.84,-8.35; INPUT -2.51,7.523; OUTPUT 0.03,7.523
PHOENIX_508_8PIN = drill 1.397 long: 1 -17.78,5.08; 2 -12.7,5.08; 3 -7.62,5.08; 4 -2.54,5.08; 5 2.54,5.08; 6 7.62,5.08; 7 12.7,5.08; 8 17.78,5.08
PHOENIX_508_2PIN = drill 1.397 long: 1 -2.54,5.08; 2 2.54,5.08
PHOENIX_508_4PIN = drill 1.397 long: 1 -7.62,5.08; 2 -2.54,5.08; 3 2.54,5.08; 4 7.62,5.08
PHOENIX_508_6PIN = drill 1.397 long: 1 -12.7,5.08; 2 -7.62,5.08; 3 -2.54,5.08; 4 2.54,5.08; 5 7.62,5.08; 6 12.7,5.08

### Placement (x,y rotation side)
PS1  101.35,17.27 180 top
S1  15.49,93.21 0 top
S3  157.23,12.95 0 top
S4  157.23,93.21 0 top
S6  86.36,12.95 0 top
S8  15.49,12.95 0 top
TP1  34.29,84.58 180 top
TP2  26.67,84.58 180 top
U1  62.23,19.04 180 top
U$1  62.23,66.03 90 top
U$2  40.64,35.55 0 top
U$3  26.04,35.55 0 top
U$4  11.43,35.55 0 top
U$5  25.91,60.95 0 top
U$6  40.39,60.95 0 top
U$7  11.43,60.95 0 top
U$8  99.69,62.22 0 top
U$9  114.3,62.22 0 top
U$10  85.09,62.22 0 top
U$11  99.69,36.82 0 top
U$12  114.3,36.82 0 top
U$13  85.09,36.82 0 top
U$14  145.42,36.82 0 top
U$15  160.02,36.82 0 top
U$16  130.81,36.82 0 top
U$17  145.42,62.22 0 top
U$18  160.02,62.22 0 top
U$19  130.81,62.22 0 top
X1  41.66,101.09 180 top
X2  86.74,101.09 180 top
X3  131.83,101.09 180 top
X4  99.06,5.07 0 top
X5  35.56,5.07 0 top
X6  129.54,5.07 0 top

### Tracks (layer width: path | path; a pad name or v marks a point on that pad's centre or on a via)
12V  (via drill 0.48)
  Top 0.762: 23.89,93.25 23.89,85.48 24.69,84.68 TP2.TP-2 | 23.89,93.25 X1.8 | 23.89,93.25 29.6,93.25 30.63,94.28 30.63,95.99 33.38,98.74 39.78,98.74 42.41,96.11 44.12,96.11 X1.4 | X4.2 101.5,10.15 101.38,10.27 101.38,17.24 PS1.1 101.73,17.35 109.16,17.35 119.67,27.87 v119.67,88.56 | 123.56,93.25 129.96,93.25 132.7,95.99 134.3,95.99 X3.4 | 123.56,93.25 120.81,95.99 120.81,97.71 119.79,98.74 116.7,98.74 114.07,96.11 X3.8 | v122.3,91.19 122.3,91.76 123.44,92.91 123.56,93.25
  Bottom 0.762: X3.8 113.96,96.11 107.78,96.11 105.16,98.74 92.13,98.74 89.61,96.22 X2.4 89.27,96.11 86.64,98.74 73.38,98.74 70.75,96.11 69.04,96.11 X2.8 68.58,96.11 65.95,98.74 48.58,98.74 45.95,96.11 44.23,96.11 X1.4 | v122.3,91.19 v119.67,88.56
BA_B
  Bottom 0.762: U$14.OUTPUT 145.5,44.44 145.5,47.99 150.99,53.47 150.99,70.73 129.5,92.22 88.01,92.22 84.24,95.99 X2.5
BA_G  (via drill 0.48)
  Top 0.762: v120.7,72.33 120.7,58.05 130.76,47.99 130.76,44.44 U$16.OUTPUT
  Bottom 0.762: v120.7,72.33 102.87,72.33 79.21,95.99 X2.6
BA_R
  Top 0.762: U$15.OUTPUT 160.13,44.44 160.13,47.99 165.39,53.24 165.39,54.5 151.68,68.22 141.39,68.22 117.39,92.22 92.81,92.22 91.78,93.25 76.81,93.25 74.07,95.99 X2.7
BB_B
  Top 0.762: U$17.OUTPUT 145.39,69.82 144.93,69.82 124.59,90.16 120.81,90.16 117.73,93.25 107.33,93.25 104.58,95.99 X2.1
BB_G  (via drill 0.48)
  Top 0.762: v120.7,79.88 130.76,69.82 U$19.OUTPUT | v82.53,94.28 82.53,97.71 83.55,98.74 96.81,98.74 99.44,96.11 X2.2
  Bottom 0.762: v120.7,79.88 96.93,79.88 v82.53,94.28
BB_R
  Bottom 0.762: U$18.OUTPUT 160.02,69.82 159.56,69.82 136.13,93.25 97.16,93.25 94.41,95.99 X2.3
CLK  (via drill 0.25)
  Top 0.254: v68.58,34.27 68.58,36.1 61.61,43.07 61.04,43.07 U$1.CLK
  Bottom 0.254: v68.58,34.27 54.63,20.33 U1.D9
DIN  (via drill 0.25)
  Top 0.254: v51.89,32.33 51.89,20.44 54.52,17.81 U1.D10
  Bottom 0.254: v51.89,32.33 51.89,41.7 55.09,44.9 61.04,44.9 62.75,43.19 63.44,43.19 U$1.DIN
FA_B  (via drill 0.48)
  Top 0.762: v40.46,100.79 124.59,100.79 129.27,96.11 X3.5
  Bottom 0.762: v40.46,100.79 37.38,97.71 37.38,95.88 30.52,89.02 30.52,82.51 25.95,77.93 25.95,68.56 U$5.OUTPUT
FA_G
  Bottom 0.762: U$7.OUTPUT 11.54,68.56 11.54,75.3 29.49,93.25 29.6,93.25 32.35,95.99 32.35,97.71 36.46,101.82 118.41,101.82 124.13,96.11 X3.6
FA_R
  Bottom 0.762: U$6.OUTPUT 40.35,68.56 40.35,76.45 34.29,82.51 34.29,87.76 42.52,95.99 42.52,97.71 44.58,99.76 115.44,99.76 119.1,96.11 X3.7
FB_B  (via drill 0.48)
  Top 0.762: v66.64,44.67 42.63,44.67 41.15,43.19 40.69,43.19 U$2.OUTPUT
  Bottom 0.762: v66.64,44.67 80.12,44.67 82.98,41.81 162.19,41.81 165.39,45.01 165.39,78.73 149.62,94.51 X3.1
FB_G
  Bottom 0.762: U$4.OUTPUT 11.43,43.19 11.43,46.73 6.17,51.99 6.17,74.85 27.32,95.99 27.32,97.82 32.35,102.85 137.73,102.85 144.47,96.11 X3.2
FB_R
  Top 0.762: U$3.OUTPUT 25.72,43.07 24.23,41.59 8.23,41.59 6.17,43.64 6.17,90.16 17.83,101.82 133.73,101.82 139.45,96.11 X3.3
GND  (via drill 0.48)
  Top 0.762: TP1.TP-1 36.23,84.68 33.15,87.76 31.66,87.76 28.57,84.68 TP2.TP-1 28.46,84.22 25.6,81.36 24,81.36 15.54,89.82 15.54,93.14 S1.P1 | S8.P1 21.03,7.41 38.75,7.41 41.38,10.04 42.86,10.04 X5.4 43.2,10.15 48.23,5.12 54.52,5.12 U1.GND@2 54.98,5.01 65.15,5.01 69.15,1.01 74.41,1.01 v82.87,9.47 | PS1.2 98.75,17.24 98.75,12.33 96.58,10.15 X4.1 96.24,10.38 89.04,10.38 86.64,12.78 S6.P1 73.38,25.93 73.38,34.27 66.06,41.59 66.06,43.07 U$1.GND
  Bottom 0.762: U$1.GND-O 65.95,88.79 65.49,88.79 63.09,86.39 37.95,86.39 36.23,84.68 TP1.TP-1 | X4.1 96.58,10.15 99.33,7.41 142.88,7.41 148.36,12.9 157.16,12.9 S3.P1 157.39,13.24 166.42,22.27 166.42,79.08 157.28,88.22 157.28,93.14 S4.P1 | v82.87,9.47 86.3,12.9 S6.P1 | S8.P1 5.14,23.3 5.14,75.19 15.43,85.48 15.43,93.14 S1.P1
  pour Top: -3.81,110.48 173.99,110.48 176.53,107.94 176.53,-2.55 175.26,-3.82 -2.54,-3.82 -5.08,-1.28 -5.08,110.48
  pour Bottom: -2.54,113.02 -2.54,-3.82 -1.27,-5.09 168.91,-5.09 173.99,-0.01 173.99,111.75 172.72,113.02 -1.27,113.02
LATCH  (via drill 0.25)
  Top 0.254: v53.26,33.7 53.26,26.73 54.52,25.47 U1.D5
  Bottom 0.254: v53.26,33.7 53.26,36.1 55.78,38.61 55.78,43.07 U$1.LAT
N$1
  Bottom 0.254: U1.D4 57.15,35.64 57.95,35.64 60.12,37.81 114.53,37.81 142.19,10.15 X6.6
N$2
  Bottom 0.254: X6.5 134.19,13.13 124.13,13.13 99.9,37.36 62.18,37.36 60.46,35.64 59.78,35.64 U1.D6
N$3
  Bottom 0.254: U1.D8 62.29,35.64 62.98,35.64 64.24,36.9 99.67,36.9 123.9,12.67 129.5,12.67 132.02,10.15 X6.4
N$4
  Top 0.254: U$1.P$1 71.09,48.33 67.78,48.33 53.84,62.27 52.81,62.27 52.12,62.96 52.12,63.99 49.26,66.85 39.55,66.85 37.95,68.45 U$6.INPUT
N$5
  Top 0.254: U$6.GND4 44.12,52.67 41.72,52.67 U$6.GND3 41.61,52.67 39.2,52.67 U$6.GND2 39.09,52.67 36.69,52.67 U$6.GND1 36.58,52.67 29.83,52.67 U$5.GND4 29.72,52.67 27.32,52.67 U$5.GND3 27.09,52.56 24.69,52.56 U$5.GND2 24.57,52.67 22.17,52.67 U$5.GND1 22.06,52.67 15.32,52.67 U$7.GND4 15.2,52.67 14.06,52.67 | U$7.GND1 7.66,52.67 10.17,52.67 U$7.GND2 10.29,52.67 12.69,52.67 U$7.GND3 12.8,52.67 14.06,52.67 | 14.06,52.67 14.06,67.19 | 14.06,67.19 14.06,68.45 U$7.GND | 14.06,67.19 26.4,67.19 27.66,68.45 28.46,68.45 U$5.GND
  Bottom 0.254: U$6.GND 42.86,68.45 42.18,68.45 40.92,67.19 29.83,67.19 28.57,68.45 U$5.GND
N$6
  Top 0.254: U$9.GND1 110.53,53.93 113.04,53.93 U$9.GND2 113.16,53.93 115.56,53.93 U$9.GND3 115.67,53.93 116.93,53.93 | 116.93,53.93 118.07,53.93 U$9.GND4 | 116.93,53.93 116.93,69.7 U$9.GND | U$10.GND1 81.38,53.93 83.78,53.93 U$10.GND2 83.9,53.93 86.3,53.93 U$10.GND3 86.41,53.93 87.67,53.93 | 87.67,53.93 88.93,53.93 U$10.GND4 | 87.67,53.93 87.67,69.7 U$10.GND | U$8.GND1 96.01,53.93 98.41,53.93 U$8.GND2 98.53,53.93 100.93,53.93 U$8.GND3 101.04,53.93 102.3,53.93 | 102.3,53.93 103.44,53.93 U$8.GND4 | 102.3,53.93 102.3,69.7 U$8.GND
  Bottom 0.254: U$10.GND4 89.04,53.93 95.9,53.93 U$8.GND1 | U$9.GND1 110.41,53.93 103.56,53.93 U$8.GND4
N$7
  Top 0.254: U1.GND@1 64.81,35.53 64.81,26.04 69.27,21.58 71.78,21.58 85.72,7.64 114.3,7.64 116.81,10.15 X6.1 X6.2 X6.3
N$8
  Bottom 0.254: U1.TX 53.49,33.01 33.15,12.67 30.52,12.67 28,10.15 X5.1
N$9
  Top 0.254: U$4.GND1 7.66,27.18 10.17,27.18 U$4.GND2 10.29,27.18 12.69,27.18 U$4.GND3 12.8,27.18 15.2,27.18 U$4.GND4 15.32,27.18 22.17,27.18 U$3.GND1 22.29,27.18 24.69,27.18 U$3.GND2 24.92,27.18 27.32,27.18 U$3.GND3 27.43,27.18 29.83,27.18 U$3.GND4 29.95,27.18 36.8,27.18 U$2.GND1 36.92,27.18 39.32,27.18 U$2.GND2 39.43,27.18 41.83,27.18 U$2.GND3 42.06,27.18 43.2,27.18 | U$4.GND 14.06,43.19 21.83,43.19 22.97,44.33 27.43,44.33 28.57,43.19 U$3.GND 28.69,43.07 36.35,43.07 37.61,41.81 43.2,41.81 | 43.2,27.18 44.46,27.18 U$2.GND4 | 43.2,27.18 43.2,41.81 | 43.2,41.81 U$2.GND
N$10
  Top 0.254: U1.RX 54.52,35.53 54.18,35.53 45.72,27.07 45.72,22.84 33.03,10.15 X5.2
N$14
  Top 0.254: 116.93,28.56 118.07,28.56 U$12.GND4 | 116.93,28.56 115.67,28.56 U$12.GND3 115.56,28.56 113.16,28.56 U$12.GND2 113.04,28.56 110.53,28.56 U$12.GND1 110.41,28.56 103.56,28.56 U$11.GND4 103.44,28.56 101.04,28.56 U$11.GND3 100.93,28.56 98.53,28.56 U$11.GND2 98.41,28.56 96.01,28.56 U$11.GND1 95.9,28.56 89.04,28.56 U$13.GND4 88.93,28.56 87.67,28.56 | 116.93,28.56 116.93,44.33 U$12.GND | U$13.GND1 81.38,28.56 83.78,28.56 U$13.GND2 83.9,28.56 86.3,28.56 U$13.GND3 86.41,28.56 87.67,28.56 | 87.67,28.56 87.67,43.07 | 87.67,43.07 87.67,44.33 U$13.GND | 87.67,43.07 100.24,43.07 101.5,44.33 102.18,44.33 U$11.GND
N$15
  Bottom 0.254: U$2.INPUT 38.18,43.19 38.86,43.19 52.12,56.44 64.12,56.44 71.09,63.42 U$1.P$6
N$16
  Top 0.254: 162.65,28.56 163.79,28.56 U$15.GND4 | 162.65,28.56 161.39,28.56 U$15.GND3 161.28,28.56 158.88,28.56 U$15.GND2 158.76,28.56 156.25,28.56 U$15.GND1 156.13,28.56 149.28,28.56 U$14.GND4 149.16,28.56 146.76,28.56 U$14.GND3 146.65,28.56 144.25,28.56 U$14.GND2 144.13,28.56 141.73,28.56 U$14.GND1 141.62,28.56 134.76,28.56 U$16.GND4 134.65,28.56 133.39,28.56 | 162.65,28.56 162.65,44.33 U$15.GND | U$16.GND1 127.1,28.56 129.5,28.56 U$16.GND2 129.62,28.56 132.02,28.56 U$16.GND3 132.13,28.56 133.39,28.56 | 133.39,28.56 133.39,43.07 | 133.39,43.07 133.39,44.33 U$16.GND | 133.39,43.07 145.96,43.07 147.22,44.33 147.9,44.33 U$14.GND
N$17
  Top 0.254: U$17.GND 148.02,69.7 154.65,69.7 155.91,68.45 161.28,68.45 162.53,69.7 U$18.GND | U$18.GND4 163.79,53.93 161.39,53.93 U$18.GND3 161.28,53.93 158.88,53.93 U$18.GND2 158.76,53.93 156.25,53.93 U$18.GND1 156.13,53.93 149.28,53.93 U$17.GND4 149.16,53.93 146.76,53.93 U$17.GND3 146.65,53.93 144.25,53.93 U$17.GND2 144.13,53.93 141.73,53.93 U$17.GND1 141.62,53.93 134.76,53.93 U$19.GND4 134.65,53.93 133.39,53.93 | U$19.GND1 127.1,53.93 129.5,53.93 U$19.GND2 129.62,53.93 132.02,53.93 U$19.GND3 132.13,53.93 133.39,53.93 | 133.39,53.93 133.39,69.7 U$19.GND
  Bottom 0.254: U$17.GND 147.9,69.7 147.22,69.7 145.96,68.45 134.65,68.45 133.39,69.7 U$19.GND
N$18
  Bottom 0.254: U$1.P$2 71.09,50.84 57.72,50.84 48.69,41.81 22.97,41.81 16.57,48.22 16.57,60.9 9.03,68.45 U$7.INPUT
N$19
  Top 0.254: U$1.P$12 71.21,83.88 71.9,83.88 73.15,85.13 74.07,85.13 89.27,69.93 89.27,55.3 97.16,47.42 97.16,44.44 U$11.INPUT
N$20
  Top 0.254: U$1.P$3 71.09,53.36 65.27,53.36 51.32,67.3 45.95,67.3 43.55,69.7 24.57,69.7 23.43,68.56 U$5.INPUT
N$21
  Bottom 0.254: U$12.INPUT 111.78,44.44 106.07,44.44 97.16,53.36 97.16,54.39 86.53,65.02 71.32,65.02 69.61,66.73 69.61,77.25 71.09,78.73 U$1.P$10
N$22  (via drill 0.25)
  Top 0.254: v63.89,57.13 69.84,57.13 U$1.P$4
  Bottom 0.254: v63.89,57.13 38.29,57.13 24.35,43.19 23.55,43.19 U$3.INPUT
N$23  (via drill 0.25)
  Top 0.254: v68.69,50.16 70.64,52.1 71.67,52.1 72.35,52.79 72.35,59.76 71.21,60.9 U$1.P$5
  Bottom 0.254: v68.69,50.16 59.66,50.16 50.86,41.36 11.43,41.36 9.72,43.07 9.03,43.07 U$4.INPUT
N$24
  Top 0.254: U$1.P$11 71.21,81.25 71.9,81.25 73.15,79.99 74.18,79.99 83.9,70.28 83.9,58.27 80.01,54.39 80.01,46.96 82.53,44.44 U$13.INPUT
N$25
  Bottom 0.254: U$1.P$7 71.21,68.56 71.9,68.56 73.61,66.85 108.93,66.85 111.78,69.7 U$9.INPUT
N$26
  Top 0.254: U$10.INPUT 82.53,69.82 81.61,69.82 76.47,74.96 73.15,74.96 72.35,74.16 72.35,72.33 71.21,71.19 U$1.P$8
N$27
  Bottom 0.254: U$8.INPUT 97.16,69.7 91.67,69.7 89.27,67.3 78.29,67.3 74.98,70.62 74.98,71.53 74.18,72.33 72.47,72.33 71.21,73.59 U$1.P$9
N$28  (via drill 0.25)
  Top 0.254: v68.24,59.53 68.24,61.02 52.12,77.13 52.12,82.62 53.26,83.76 U$1.P$13
  Bottom 0.254: v68.24,59.53 70.64,57.13 71.67,57.13 76.69,52.1 81.72,52.1 91.21,42.61 148.02,42.61 149.73,44.33 157.5,44.33 U$15.INPUT
N$29  (via drill 0.25)
  Top 0.254: v71.55,65.7 64.92,65.7 54.63,75.99 54.63,79.99 53.38,81.25 U$1.P$14
  Bottom 0.254: v71.55,65.7 108.13,65.7 128.25,45.59 128.25,44.44 U$16.INPUT
N$30  (via drill 0.25)
  Top 0.254: v70.29,59.65 53.38,76.56 53.38,78.73 U$1.P$15
  Bottom 0.254: v70.29,59.65 74.18,59.65 74.98,58.85 74.98,58.39 80.81,52.56 81.95,52.56 91.44,43.07 133.84,43.07 135.1,44.33 142.88,44.33 U$14.INPUT
N$31  (via drill 0.25)
  Top 0.254: v150.08,70.39 154.65,70.39 155.22,69.82 157.5,69.82 U$18.INPUT | v63.89,73.59 v70.29,67.19
  Bottom 0.254: v150.08,70.39 150.08,70.05 146.42,66.39 71.09,66.39 v70.29,67.19 | v63.89,73.59 53.38,73.59 U$1.P$16
N$32  (via drill 0.25)
  Top 0.254: v78.52,67.99 74.87,67.99 73.38,66.5 65.04,66.5 v60.46,71.08
  Bottom 0.254: v78.52,67.99 89.27,67.99 92.35,71.08 117.27,71.08 118.53,69.82 128.25,69.82 U$19.INPUT | v60.46,71.08 53.38,71.08 U$1.P$17
N$33
  Bottom 0.254: U$1.P$18 53.38,68.68 59.89,68.68 69.84,78.62 69.84,79.19 70.64,79.99 74.18,79.99 79.21,74.96 79.21,70.16 80.92,68.45 89.04,68.45 92.13,71.53 141.16,71.53 142.88,69.82 U$17.INPUT
NA_B
  Top 0.762: U$8.OUTPUT 99.67,69.82 99.21,69.82 78.87,90.16 69.49,90.16 67.67,91.99 43.2,91.99 39.2,95.99 X1.5
NA_G  (via drill 0.48)
  Top 0.762: v81.04,71.42 76.24,76.22 63.09,76.22 48.35,90.96 39.09,90.96 34.06,95.99 X1.6
  Bottom 0.762: v81.04,71.42 83.1,71.42 84.7,69.82 85.04,69.82 U$10.OUTPUT
NA_R
  Top 0.762: U$9.OUTPUT 114.3,69.82 113.84,69.82 91.44,92.22 68.81,92.22 61.27,99.76 32.69,99.76 29.03,96.11 X1.7
NB_B  (via drill 0.48)
  Top 0.762: v90.07,72.33 90.07,57.59 99.67,47.99 99.67,44.44 U$11.OUTPUT
  Bottom 0.762: v90.07,72.33 69.15,93.25 62.18,93.25 X1.1
NB_G  (via drill 0.48)
  Top 0.762: v80.01,70.39 80.01,68.22 79.21,67.42 79.21,45.59 81.95,42.84 83.21,42.84 84.7,44.33 85.04,44.33 U$13.OUTPUT | v50.98,93.02 51.32,93.02 54.29,95.99 X1.2
  Bottom 0.762: v80.01,70.39 80.01,79.65 68.47,91.19 52.81,91.19 v50.98,93.02
NB_R  (via drill 0.48)
  Top 0.762: v69.84,91.19 82.98,91.19 103.78,70.39 103.78,58.5 114.3,47.99 114.3,44.44 U$12.OUTPUT
  Bottom 0.762: v69.84,91.19 68.81,92.22 53.15,92.22 49.38,95.99 X1.3
OE  (via drill 0.25)
  Top 0.254: v52.58,33.01 52.58,24.9 54.52,22.96 U1.D7
  Bottom 0.254: v52.58,33.01 52.58,41.7 55.32,44.44 56.35,44.44 57.61,43.19 58.41,43.19 U$1.OE
VCC
  Top 0.762: U$1.P$43 73.72,68.68 73.72,71.08 U$1.P$44 73.72,71.42 73.72,73.59 U$1.P$45 | U$1.P$47 73.72,81.36 73.72,83.76 U$1.P$48 | U$1.P$46 73.27,78.73 71.78,77.25 70.41,77.25 68.58,79.08 U$1.VCC-O | U$1.P$42 73.72,63.42 73.72,61.25 U$1.P$41 73.72,60.9 73.72,58.5 U$1.P$40 73.72,58.05 73.72,53.7 U$1.P$39 73.72,53.24 73.72,51.07 U$1.P$38 73.72,50.73 73.72,48.56 U$1.P$37 73.61,48.22 68.58,43.19 U$1.VCC | U$1.P$54 50.86,63.42 50.86,61.25 U$1.P$53 50.86,60.9 50.86,58.5 U$1.P$52 50.86,58.05 50.86,53.7 U$1.P$51 50.86,53.24 50.86,51.07 U$1.P$50 50.86,50.73 50.86,48.33 U$1.P$49 51.21,48.22 52.69,46.73 65.95,46.73 68.81,43.87 U$1.VCC | U$1.P$55 50.86,68.68 50.86,71.08 U$1.P$56 50.86,71.42 50.86,73.59 U$1.P$57 50.86,73.93 50.86,78.39 U$1.P$58 50.86,78.73 50.86,81.25 U$1.P$59 | U$1.P$60 50.86,83.76 50.86,81.59 U$1.P$59 | TP1.TP-2 32.46,84.56 32.46,84.33 35.55,81.25 50.41,81.25 U$1.P$59 | PS1.3 96.24,17.35 90.3,17.35 74.41,33.24 74.41,37.13 68.69,42.84 U$1.VCC
  Bottom 0.762: PS1.3 96.24,17.35 82.18,17.35 69.95,5.12 U1.5V 69.61,4.78 65.84,1.01 48.92,1.01 39.78,10.15 X5.3 | U$1.P$46 73.72,78.73 73.72,73.7 U$1.P$45 | U$1.P$48 73.61,83.76 68.58,88.79 U$1.VCC-O 68.24,88.68 68.01,88.68 64.69,85.36 52.35,85.36 U$1.P$60 | U$1.P$54 50.86,63.53 50.86,68.56 U$1.P$55

### Text on the board
tNames: DOT: Bird Beaks / V3.0 / 2/10/23 / Aaron De Lanty | 12v | GND | 5v | GND | OMSI | RX | TX | 5V | GND